# Altium project PCB_Project.PrjPcb
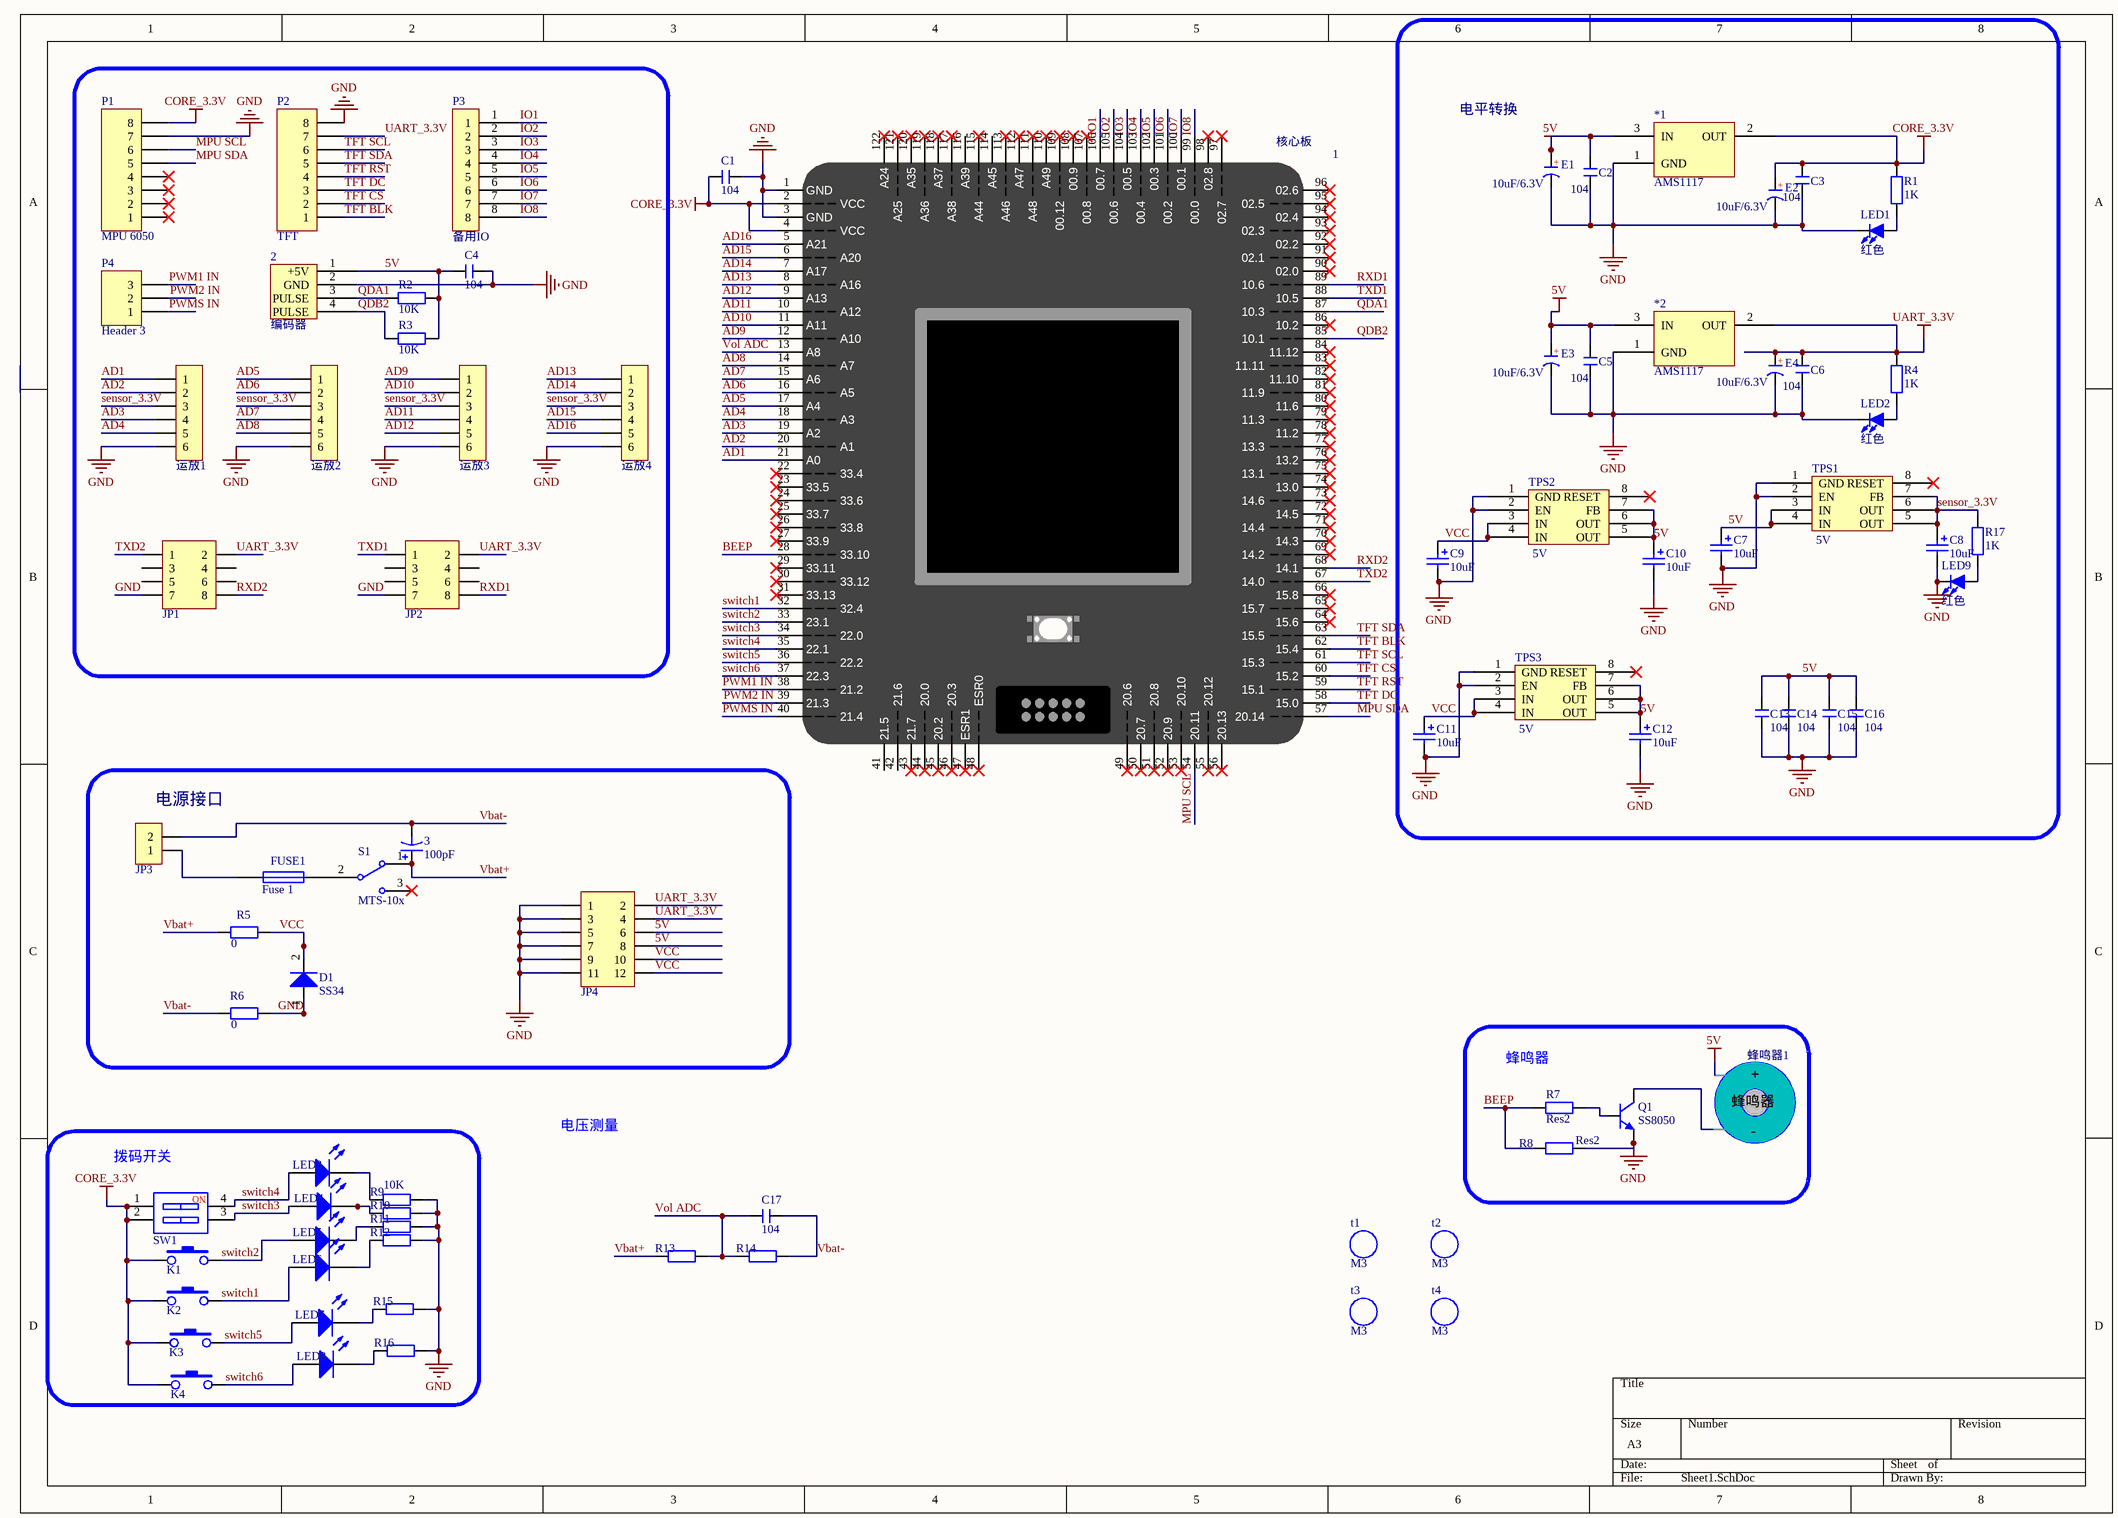
[diagram p0: Sheet1.SchDoc]
1 sheet, 81 parts. Net scope: global (net labels, ports and power ports of the same name join across sheets).
Board file: PCB1.PcbDoc

## Sheet Sheet1.SchDoc
size A3; SheetNumber: 1; SheetTotal: 1

### Parts
1  核心板  [TC264_CoreBoard]
2  编码器  [HDR1X4]
3  value 100pF  [CAP 5.0*10*20 - BK]  (hidden comment: Cap Pol3)
*1  AMS1117  [SOT223_M]
*2  AMS1117  [SOT223_M]
C1  104  [C 0603_M]
C2  104  [C 0603_M]
C3  104  [C 0603_M]
C4  104  [C 0603_M]
C5  104  [C 0603_M]
C6  104  [C 0603_M]
C7  10uf  [C3216]
C8  10uf  [C3216]
C9  10uf  [C3216]
C10  10uf  [C3216]
C11  10uf  [C3216]
C12  10uf  [C3216]
C13  104  [C 0603_M]
C14  104  [C 0603_M]
C15  104  [C 0603_M]
C16  104  [C 0603_M]
C17  104  [C 0603_M]
D1  SS34  [SMA]
E1  10uF/6.3V  [CD A(3216)]
E2  10uF/6.3V  [CD A(3216)]
E3  10uF/6.3V  [CD A(3216)]
E4  10uF/6.3V  [CD A(3216)]
FUSE1  Fuse 1  [FU 0805]
JP1  Header 4X2  [HDR2.54-LI-2x4P]  (value not drawn)
JP2  Header 4X2  [HDR2.54-LI-2x4P]  (value not drawn)
JP3  HDR-1X2  [KF301-5.0-2P]  (value not drawn)
JP4  Header 6X2  [HDR2.54-LI-2x6P]  (value not drawn)
K1  K2  [KEY-SMD1]  (value not drawn)
K2  K2  [KEY-SMD1]  (value not drawn)
K3  K2  [KEY-SMD1]  (value not drawn)
K4  K2  [KEY-SMD1]  (value not drawn)
LED1  红色  [LED 0805B]
LED2  红色  [LED 0805B]
LED3  LED4  [LED 0805B]  (value not drawn)
LED4  LED4  [LED 0805B]  (value not drawn)
LED5  LED4  [LED 0805B]  (value not drawn)
LED6  LED4  [LED 0805B]  (value not drawn)
LED7  LED4  [LED 0805B]  (value not drawn)
LED8  LED4  [LED 0805B]  (value not drawn)
LED9  红色  [LED 0805B]
P1  MPU 6050  [HDR1X8]
P2  TFT  [HDR1X8]
P3  备用IO  [HDR1X8]
P4  Header 3  [HDR1X3]
Q1  SS8050  [SOT23-3N]
R1  1K  [R0805]
R2  10K  [R0805]
R3  10K  [R0805]
R4  1K  [R0805]
R5  0  [R1210]
R6  0  [R1210]
R7  Res2  [R0805]
R8  Res2  [R0805]
R9  10K  [R0805]
R10  10K  [R0805]  (value not drawn)
R11  10K  [R0805]  (value not drawn)
R12  10K  [R0805]  (value not drawn)
R13  10K  [R0805]  (value not drawn)
R14  10K  [R0805]  (value not drawn)
R15  10K  [R0805]  (value not drawn)
R16  10K  [R0805]  (value not drawn)
R17  1K  [R0805]
S1  MTS-10x  [MTS-10x]
SW1  CSW-2P  [CSW DIP-2P_G]  (value not drawn)
t1  M3  [M3 125X200]
t2  M3  [M3 125X200]
t3  M3  [M3 125X200]
t4  M3  [M3 125X200]
TPS1  5V  [SO-8N]
TPS2  5V  [SO-8N]
TPS3  5V  [SO-8N]
蜂鸣器1  蜂鸣器  [BELL 7.6mm]  (value not drawn)
运放1  HDR-1X6  [XH2.54-LI-6P]  (value not drawn)
运放2  HDR-1X6  [XH2.54-LI-6P]  (value not drawn)
运放3  HDR-1X6  [XH2.54-LI-6P]  (value not drawn)
运放4  HDR-1X6  [XH2.54-LI-6P]  (value not drawn)

### Blocks framed on the sheet
电平转换: *1 *2 C2 C3 C5-C16 E1-E4 LED1 LED2 LED9 R1 R4 R17 TPS1-TPS3
电源接口: 3 D1 FUSE1 JP3 JP4 R5 R6 S1
蜂鸣器: Q1 R7 R8 蜂鸣器1
拨码开关: K1-K4 LED3-LED8 R9-R12 R15 R16 SW1

### Nets
5V: 2.1(+5V) *1.3(IN) *2.3(IN) C2.2 C4.2 C5.2 C7.1 C10.1 C12.1 C13.1 C14.1 C15.1 C16.1 E1.1(A) E3.1(A) JP4.6 JP4.8 R2.2 R3.1 TPS1.3(IN) TPS1.4(IN) TPS2.5(OUT) TPS2.6(OUT) TPS2.7(FB) TPS3.5(OUT) TPS3.6(OUT) TPS3.7(FB) 蜂鸣器1.1
CORE_3.3V: 1.2(VCC) 1.4(VCC) *1.2(OUT) C1.2 C3.2 E2.1(A) K1.1 K2.1 K3.1 K4.1 P1.8 R1.2 SW1.1 SW1.2
GND: 1.1(GND) 1.3(GND) 2.2(GND) *1.1(GND) *2.1(GND) C1.1 C2.1 C3.1 C4.1 C5.1 C6.1 C7.2 C8.2 C9.2 C10.2 C11.2 C12.2 C13.2 C14.2 C15.2 C16.2 D1.1(A) E1.2(K) E2.2(K) E3.2(K) E4.2(K) JP1.7 JP2.7 JP4.1 JP4.3 JP4.5 JP4.7 JP4.9 JP4.11 LED1.2(K) LED2.2(K) LED9.2(K) P1.7 P2.8 Q1.2(E) R6.1(vcc) R8.2 R9.2 R10.2 R11.2 R12.2 R15.2 R16.2 TPS1.1(GND) TPS1.2(EN) TPS2.1(GND) TPS2.2(EN) TPS3.1(GND) TPS3.2(EN) 运放1.6 运放2.6 运放3.6 运放4.6
UART_3.3V: *2.2(OUT) C6.2 E4.1(A) JP1.2 JP2.2 JP4.2 JP4.4 P2.7 R4.2
AD1: 1.21(A0) 运放1.1
AD2: 1.20(A1) 运放1.2
AD3: 1.19(A2) 运放1.4
AD4: 1.18(A3) 运放1.5
AD5: 1.17(A4) 运放2.1
AD6: 1.16(A5) 运放2.2
AD7: 1.15(A6) 运放2.4
AD8: 1.14(A7) 运放2.5
AD9: 1.12(A10) 运放3.1
AD10: 1.11(A11) 运放3.2
AD11: 1.10(A12) 运放3.4
AD12: 1.9(A13) 运放3.5
AD13: 1.8(A16) 运放4.1
AD14: 1.7(A17) 运放4.2
AD15: 1.6(A20) 运放4.4
AD16: 1.5(A21) 运放4.5
BEEP: 1.28(33.10) R7.2 R8.1
IO1: 1.106(00.7) P3.1
IO2: 1.105(00.6) P3.2
IO3: 1.104(00.5) P3.3
IO4: 1.103(00.4) P3.4
IO5: 1.102(00.3) P3.5
IO6: 1.101(00.2) P3.6
IO7: 1.100(00.1) P3.7
IO8: 1.99(00.0) P3.8
MPU SCL: 1.54(20.11) P1.6
MPU SDA: 1.57(20.14) P1.5
PWM1 IN: 1.38(21.2) P4.3
PWM2 IN: 1.39(21.3) P4.2
PWMS IN: 1.40(21.4) P4.1
QDA1: 1.87(10.3) 2.3(PULSE) R2.1
QDB2: 1.85(10.1) 2.4(PULSE) R3.2
RXD1: 1.89(10.6) JP2.8
RXD2: 1.68(14.1) JP1.8
sensor_3.3V: C8.1 R17.2 TPS1.5(OUT) TPS1.6(OUT) TPS1.7(FB) 运放1.3 运放2.3 运放3.3 运放4.3
switch1: 1.32(32.4) K2.2 LED6.1(A)
switch2: 1.33(23.1) K1.2 LED5.1(A)
switch3: 1.34(22.0) LED4.1(A) SW1.3
switch4: 1.35(22.1) LED3.1(A) SW1.4
switch5: 1.36(22.2) K3.2 LED7.1(A)
switch6: 1.37(22.3) K4.2 LED8.1(A)
TFT BLK: 1.62(15.4) P2.1
TFT CS: 1.60(15.2) P2.2
TFT DC: 1.58(15.0) P2.3
TFT RST: 1.59(15.1) P2.4
TFT SCL: 1.61(15.3) P2.6
TFT SDA: 1.63(15.5) P2.5
TXD1: 1.88(10.5) JP2.1
TXD2: 1.67(14.0) JP1.1
Vbat+: 3.1 R5.2 R13.1 S1.1
Vbat-: 3.2 C17.1 JP3.1(2) R6.2 R14.2
VCC: C9.1 C11.1 D1.2(K) JP4.10 JP4.12 R5.1(vcc) TPS2.3(IN) TPS2.4(IN) TPS3.3(IN) TPS3.4(IN)
Vol ADC: 1.13(A8) C17.2 R13.2 R14.1
NetFUSE1_1: FUSE1.1 JP3.2(1)
NetFUSE1_2: FUSE1.2 S1.2
NetLED1_1: LED1.1(A) R1.1
NetLED2_1: LED2.1(A) R4.1
NetLED3_2: LED3.2(K) R9.1
NetLED4_2: LED4.2(K) R10.1
NetLED5_2: LED5.2(K) R11.1
NetLED6_2: LED6.2(K) R12.1
NetLED7_2: LED7.2(K) R15.1
NetLED8_2: LED8.2(K) R16.1
NetLED9_1: LED9.1(A) R17.1
NetQ1_1: Q1.1(B) R7.1
NetQ1_3: Q1.3(C) 蜂鸣器1.2

Not connected (* = marked no-connect by the designer): 1 22(33.4)* 23(33.5)* 24(33.6)* 25(33.7)* 26(33.8)* 27(33.9)* 29(33.11)* 30(33.12)* 31(33.13)* 41(21.5) 42(21.6) 43(21.7)* 44(20.0)* 45(20.2)* 46(20.3)* 47(ESR1)* 48(ESR0)* 49(20.6)* 50(20.7)* 51(20.8)* 52(20.9)* 53(20.10)* 55(20.12)* 56(20.13)* 64(15.6)* 65(15.7)* 66(15.8)* 69(14.2)* 70(14.3)* 71(14.4)* 72(14.5)* 73(14.6)* 74(13.0)* 75(13.1)* 76(13.2)* 77(13.3)* 78(11.2)* 79(11.3)* 80(11.6)* 81(11.9)* 82(11.10)* 83(11.11)* 84(11.12)* 86(10.2)* 90(02.0)* 91(02.1)* 92(02.2)* 93(02.3)* 94(02.4)* 95(02.5)* 96(02.6)* 97(02.7)* 98(02.8)* 107(00.8)* 108(00.9)* 109(00.12)* 110(A49)* 111(A48)* 112(A47)* 113(A46)* 114(A45) 115(A44)* 116(A39) 117(A38)* 118(A37)* 119(A36)* 120(A35)* 121(A25)* 122(A24)*; JP1 3 4 5 6; JP2 3 4 5 6; P1 1* 2* 3* 4*; S1 3*; TPS1 8(RESET)*; TPS2 8(RESET)*; TPS3 8(RESET)*

### Notes on the sheet
- 电压测量
- (in symbol C-CD) +
- (in symbol CSW-2P) NO
- (in symbol 蜂鸣器) +; -

### Library data of the parts
1 = Component_1
2 = 光电码盘
3 = Cap Pol3: Polarized Capacitor (Surface Mount); Published: 8-Jun-2000; LatestRevisionDate: 29-May-2009; LatestRevisionNote: IPC-7351 Footprint Added.; PackageReference: C0805; Publisher: Altium Limited; PackageDescription: Chip Capacitor
C1-C6 C13-C17 = C: 无极性贴片电容; 版权归属: 源创客; BOM名称: 无极性贴片电容; 学习资源: www.ooocke.com
C7-C12 = Cap Pol1: Polarized Capacitor (Radial); Published: 8-Jun-2000; LatestRevisionDate: 17-Jul-2002; LatestRevisionNote: Re-released for DXP Platform.; PackageReference: RB7.6-15; Publisher: Altium Limited; PackageDescription: Polarized Capacitor (Radial); 2 Leads; Value: 10uF
D1 = Diode 1N4148: High Conductance Fast Diode; Published: 8-Jun-2000; LatestRevisionDate: 17-Jul-2002; LatestRevisionNote: Re-released for DXP Platform.; DatasheetVersion: 1997; PackageReference: DO-35; Publisher: Altium Limited; Code_JEDEC: DO-204-AH; ComponentLink1Description: Manufacturer Link; ComponentLink1URL: http://www.fairchildsemi.com/; ComponentLink2Description: Datasheet; ComponentLink2URL: http://www.fairchildsemi.com/ds/1N%2F1N4148.pdf
E1-E4 = C-CD: 贴片钽电容; 版权归属: 源创客; BOM名称: 贴片钽电容; 学习资源: www.ooocke.com
FUSE1 = Fuse 1: Fuse; Published: 8-Jun-2000; LatestRevisionDate: 17-Jul-2002; LatestRevisionNote: Re-released for DXP Platform.; PackageReference: PIN-W2/E2.8; Publisher: Altium Limited; PackageDescription: Thru-Hole; 2 Leads
JP1 JP2 = Header 4X2: 4*2P接插件; 版权归属: 源创客; BOM名称: 4*2P接插件; 学习资源: www.ooocke.com
JP3 = Header 2: 2P接插件; 版权归属: 源创客; BOM名称: 2P接插件; 学习资源: www.ooocke.com
JP4 = Header  6X2: 6*2P接插件; 版权归属: 源创客; BOM名称: 6*2P接插件; 学习资源: www.ooocke.com
K1-K4 = KEY_1: 按键
LED1 LED2 LED9 = LED-SMD: 贴片LED; 版权归属: 源创客; BOM名称: 贴片LED; 学习资源: www.ooocke.com
LED3-LED8 = LED2: Typical RED, GREEN, YELLOW, AMBER GaAs LED; Published: 8-Jun-2000; LatestRevisionDate: 17-Jul-2002; LatestRevisionNote: Re-released for DXP Platform.; PackageVersion: Feb-2002; PackageReference: 3.2X1.6X1.1; Publisher: Altium Limited
P1 P2 = Header 8: Header, 8-Pin; LatestRevisionDate: 17-Jul-2002; LatestRevisionNote: Re-released for DXP Platform.; Publisher: Altium Limited
P4 = Header 3: Header, 3-Pin; LatestRevisionDate: 17-Jul-2002; LatestRevisionNote: Re-released for DXP Platform.; Publisher: Altium Limited
Q1 = 8050-SMD: 高频放大-NPN型; 版权归属: 源创客; 属性: 40V 1.5A 1W 100MHZ; BOM名称: 高频放大-NPN型; 学习资源: www.ooocke.com
R1 R4 R17 = R: 贴片电阻; 版权归属: 源创客; BOM名称: 贴片电阻; 学习资源: www.ooocke.com
R2 R3 R5 R6 = RES_MD
R7 R8 = Res2: Resistor; Value: 1K; Published: 8-Jun-2000; LatestRevisionDate: 17-Jul-2002; LatestRevisionNote: Re-released for DXP Platform.; PackageReference: AXIAL-0.4; Publisher: Altium Limited; PackageDescription: Axial Device, Thru-Hole; 2 Leads; 0.4 in Pin Spacing
R9-R16 = 电阻: Resistor; Published: 8-Jun-2000; LatestRevisionDate: 17-Jul-2002; LatestRevisionNote: Re-released for DXP Platform.; PackageReference: AXIAL-0.4; Publisher: Altium Limited; PackageDescription: Axial Device, Thru-Hole; 2 Leads; 0.4 in Pin Spacing
  R9: Value: 10K
  R10-R16: value: 10K
S1 = MTS-10x: MTS10x系列3脚扭子开关; 版权归属: 源创客; BOM名称: MTS10x系列3脚扭子开关; 学习资源: www.ooocke.com
SW1 = CSW-2P: 2路编码开关; 版权归属: 源创客; BOM名称: 2路编码开关; 学习资源: www.ooocke.com
t1-t4 = M3: 铜柱孔; 版权归属: 源创客; BOM名称: 铜柱孔; 学习资源: www.ooocke.com
TPS1-TPS3 = TPS7350
运放1-运放4 = Header 6: 6P接插件; 封装库来自淘宝卖家 ID：黄晶宝石: 其他店铺购入均为盗版，不享受售后技术支持服务，请立即申请退款